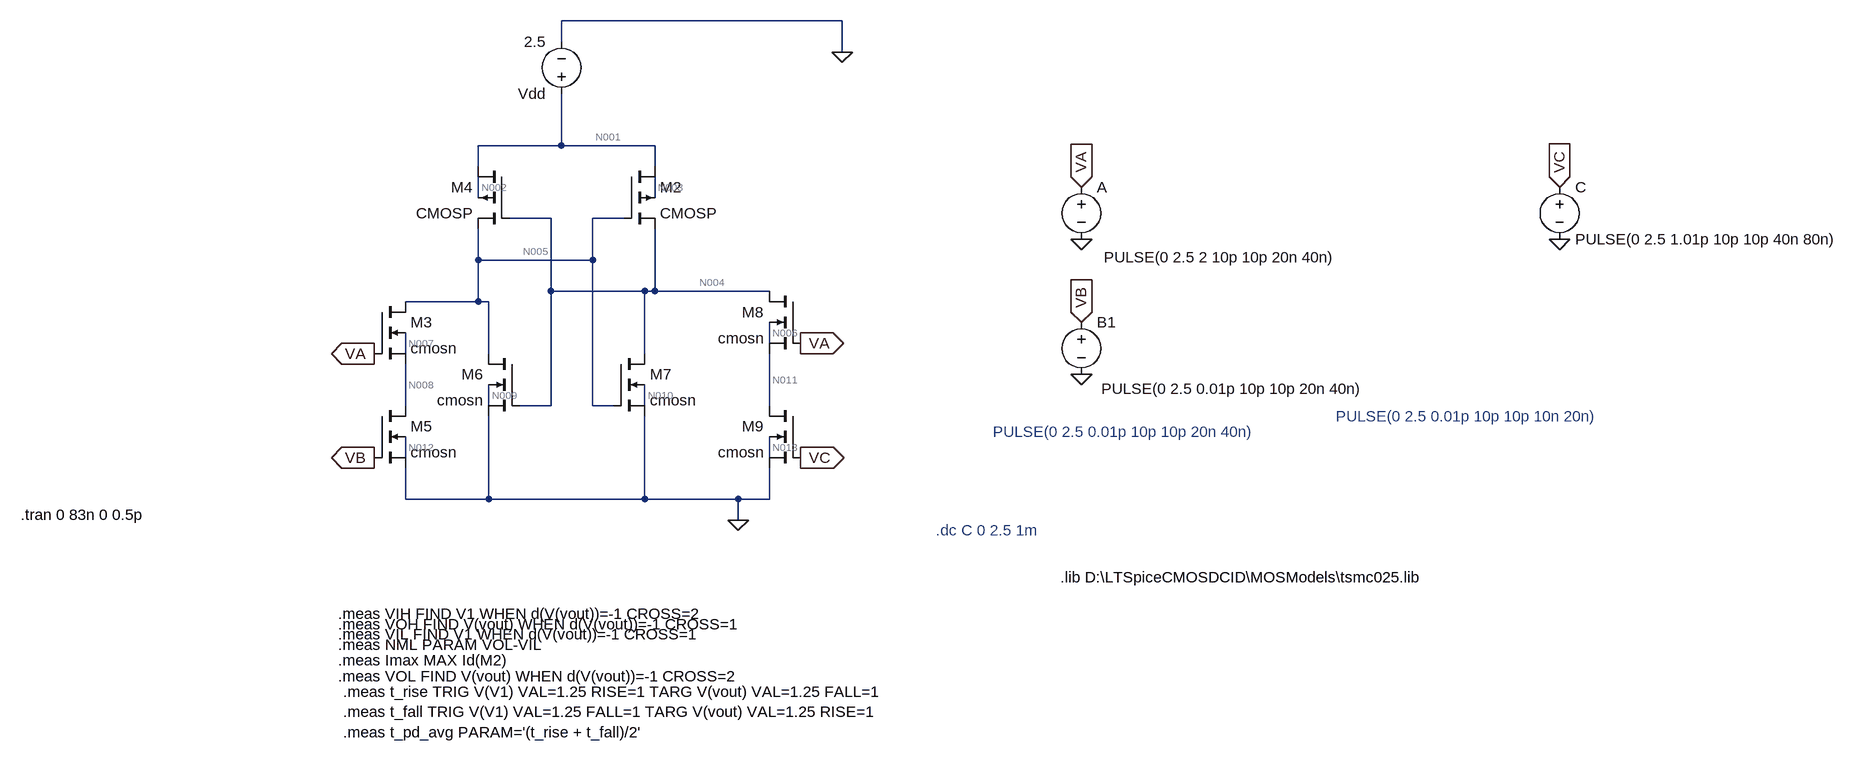
[diagram p0: schematic NOR Latch.asc]
NOR Latch.asc, the LTspice schematic file:
Version 4
SHEET 1 2744 680
WIRE 1184 -512 752 -512
WIRE 752 -480 752 -512
WIRE 1184 -464 1184 -512
WIRE 752 -320 752 -400
WIRE 752 -320 624 -320
WIRE 896 -320 752 -320
WIRE 624 -288 624 -320
WIRE 896 -288 896 -320
WIRE 624 -240 624 -272
WIRE 896 -240 896 -272
WIRE 736 -208 672 -208
WIRE 848 -208 800 -208
WIRE 624 -144 624 -192
WIRE 800 -144 800 -208
WIRE 800 -144 624 -144
WIRE 736 -96 736 -208
WIRE 880 -96 736 -96
WIRE 896 -96 896 -192
WIRE 896 -96 880 -96
WIRE 1072 -96 896 -96
WIRE 624 -80 624 -144
WIRE 624 -80 512 -80
WIRE 640 -80 624 -80
WIRE 1072 -16 1072 -48
WIRE 512 0 512 -32
WIRE 640 0 640 -80
WIRE 880 0 880 -96
WIRE 512 80 512 16
WIRE 640 80 640 48
WIRE 736 80 736 -96
WIRE 736 80 688 80
WIRE 800 80 800 -144
WIRE 832 80 800 80
WIRE 880 80 880 48
WIRE 1072 80 1072 0
WIRE 512 160 512 128
WIRE 1072 160 1072 128
WIRE 512 224 512 176
WIRE 640 224 640 96
WIRE 640 224 512 224
WIRE 880 224 880 96
WIRE 880 224 640 224
WIRE 1024 224 880 224
WIRE 1072 224 1072 176
WIRE 1072 224 1024 224
WIRE 1024 256 1024 224
FLAG 1024 256 0
FLAG 1184 -464 0
FLAG 1552 -256 VA
IOPIN 1552 -256 In
FLAG 2288 -256 VC
IOPIN 2288 -256 In
FLAG 1552 -176 0
FLAG 2288 -176 0
FLAG 1552 -48 VB
IOPIN 1552 -48 In
FLAG 1552 32 0
FLAG 464 0 VA
IOPIN 464 0 Out
FLAG 1120 -16 VA
IOPIN 1120 -16 Out
FLAG 464 160 VB
IOPIN 464 160 Out
FLAG 1120 160 VC
IOPIN 1120 160 Out
SYMBOL voltage 752 -384 R180
WINDOW 123 0 0 Left 0
WINDOW 39 0 0 Left 0
SYMATTR InstName Vdd
SYMATTR Value 2.5
SYMBOL cmosp 672 -288 M0
SYMATTR InstName M4
SYMATTR Value2 l=250n w=360n ad=0.1728p as=0.1728p pd=1680n ps=1680n
SYMBOL voltage 1552 -272 R0
WINDOW 3 35 124 Left 2
WINDOW 123 0 0 Left 0
WINDOW 39 0 0 Left 0
SYMATTR Value PULSE(0 2.5 2 10p 10p 20n 40n)
SYMATTR InstName A
SYMBOL voltage 2288 -272 R0
WINDOW 123 0 0 Left 0
WINDOW 39 0 0 Left 0
SYMATTR InstName C
SYMATTR Value PULSE(0 2.5 1.01p 10p 10p 40n 80n)
SYMBOL voltage 1552 -64 R0
WINDOW 3 31 118 Left 2
WINDOW 123 0 0 Left 0
WINDOW 39 0 0 Left 0
SYMATTR Value PULSE(0 2.5 0.01p 10p 10p 20n 40n)
SYMATTR InstName B1
SYMBOL cmosp 848 -288 R0
SYMATTR InstName M2
SYMATTR Value2 l=250n w=360n ad=0.1728p as=0.1728p pd=1680n ps=1680n
SYMBOL nmos4 464 -80 R0
SYMATTR InstName M3
SYMATTR Value cmosn
SYMATTR Value2 l=250n w=360n ad=0.1728p as=0.1728p pd=1680n ps=1680n
SYMBOL nmos4 464 80 R0
SYMATTR InstName M5
SYMATTR Value cmosn
SYMATTR Value2 l=250n w=360n ad=0.1728p as=0.1728p pd=1680n ps=1680n
SYMBOL nmos4 688 0 M0
SYMATTR InstName M6
SYMATTR Value cmosn
SYMATTR Value2 l=250n w=360n ad=0.1728p as=0.1728p pd=1680n ps=1680n
SYMBOL nmos4 832 0 R0
SYMATTR InstName M7
SYMATTR Value cmosn
SYMATTR Value2 l=250n w=360n ad=0.1728p as=0.1728p pd=1680n ps=1680n
SYMBOL nmos4 1120 -96 M0
SYMATTR InstName M8
SYMATTR Value cmosn
SYMATTR Value2 l=250n w=360n ad=0.1728p as=0.1728p pd=1680n ps=1680n
SYMBOL nmos4 1120 80 M0
SYMATTR InstName M9
SYMATTR Value cmosn
SYMATTR Value2 l=250n w=360n ad=0.1728p as=0.1728p pd=1680n ps=1680n
TEXT 1520 344 Left 2 !.lib D:\\LTSpiceCMOSDCID\\MOSModels\\tsmc025.lib
TEXT 408 496 Left 2 !.meas VOL FIND V(vout) WHEN d(V(vout))=-1 CROSS=2
TEXT 408 400 Left 2 !.meas VIH FIND V1 WHEN d(V(vout))=-1 CROSS=2
TEXT 408 416 Left 2 !.meas VOH FIND V(vout) WHEN d(V(vout))=-1 CROSS=1
TEXT 408 432 Left 2 !.meas VIL FIND V1 WHEN d(V(vout))=-1 CROSS=1
TEXT 408 448 Left 2 !.meas NML PARAM VOL-VIL
TEXT 408 472 Left 2 !.meas Imax MAX Id(M2)
TEXT 416 520 Left 2 !.meas t_rise TRIG V(V1) VAL=1.25 RISE=1 TARG V(vout) VAL=1.25 FALL=1\n.meas t_fall TRIG V(V1) VAL=1.25 FALL=1 TARG V(vout) VAL=1.25 RISE=1\n.meas t_pd_avg PARAM='(t_rise + t_fall)/2'
TEXT -80 248 Left 2 !.tran 0 83n 0 0.5p
TEXT 1328 272 Left 2 ;.dc C 0 2.5 1m
TEXT 1416 120 Left 2 ;PULSE(0 2.5 0.01p 10p 10p 20n 40n)
TEXT 1944 96 Left 2 ;PULSE(0 2.5 0.01p 10p 10p 10n 20n)

The netlist it stands for:
* NOR Latch.asc
Vdd N001 0 2.5
M4 N001 N004 N005 N002 CMOSP l=250n w=360n ad=0.1728p as=0.1728p pd=1680n ps=1680n
V§A VA 0 PULSE(0 2.5 2 10p 10p 20n 40n)
V§C VC 0 PULSE(0 2.5 1.01p 10p 10p 40n 80n)
V§B1 VB 0 PULSE(0 2.5 0.01p 10p 10p 20n 40n)
M2 N001 N005 N004 N003 CMOSP l=250n w=360n ad=0.1728p as=0.1728p pd=1680n ps=1680n
M3 N005 VA N008 N007 cmosn l=250n w=360n ad=0.1728p as=0.1728p pd=1680n ps=1680n
M5 N008 VB 0 N012 cmosn l=250n w=360n ad=0.1728p as=0.1728p pd=1680n ps=1680n
M6 N005 N004 0 N009 cmosn l=250n w=360n ad=0.1728p as=0.1728p pd=1680n ps=1680n
M7 N004 N005 0 N010 cmosn l=250n w=360n ad=0.1728p as=0.1728p pd=1680n ps=1680n
M8 N004 VA N011 N006 cmosn l=250n w=360n ad=0.1728p as=0.1728p pd=1680n ps=1680n
M9 N011 VC 0 N013 cmosn l=250n w=360n ad=0.1728p as=0.1728p pd=1680n ps=1680n
.model NMOS NMOS
.model PMOS PMOS
.lib standard.mos
.lib D:\LTSpiceCMOSDCID\MOSModels\tsmc025.lib
.meas VOL FIND V(vout) WHEN d(V(vout))=-1 CROSS=2
.meas VIH FIND V1 WHEN d(V(vout))=-1 CROSS=2
.meas VOH FIND V(vout) WHEN d(V(vout))=-1 CROSS=1
.meas VIL FIND V1 WHEN d(V(vout))=-1 CROSS=1
.meas NML PARAM VOL-VIL
.meas Imax MAX Id(M2)
.meas t_rise TRIG V(V1) VAL=1.25 RISE=1 TARG V(vout) VAL=1.25 FALL=1
.meas t_fall TRIG V(V1) VAL=1.25 FALL=1 TARG V(vout) VAL=1.25 RISE=1
.meas t_pd_avg PARAM='(t_rise + t_fall)/2'
.tran 0 83n 0 0.5p
* .dc C 0 2.5 1m
* PULSE(0 2.5 0.01p 10p 10p 20n 40n)
* PULSE(0 2.5 0.01p 10p 10p 10n 20n)
.backanno
.end

* Results of the author's LTspice run, read from the files saved beside the schematic
* Operating Point, zero values left out:
*   V(n001) = 2.5 V
*   V(n004) = 931 mV
*   V(n005) = 931 mV
*   V(n002) = 2.222 V
*   V(n003) = 2.222 V
*   V(n008) = 227.8 mV
*   V(n007) = 374.8 mV
*   V(n012) = 75.28 mV
*   V(n009) = 204.4 mV
*   V(n010) = 204.4 mV
*   V(n011) = 227.8 mV
*   V(n006) = 374.8 mV
*   V(n013) = 75.28 mV
*   Id(M4) = 21.59 µA
*   Ib(M4) = -2.222 pA
*   Is(M4) = -21.59 µA
*   Id(M2) = 21.59 µA
*   Ib(M2) = -2.222 pA
*   Is(M2) = -21.59 µA
*   Id(M6) = 21.59 µA
*   Is(M6) = -21.59 µA
*   Id(M7) = 21.59 µA
*   Is(M7) = -21.59 µA
*   I(Vdd) = -43.18 µA
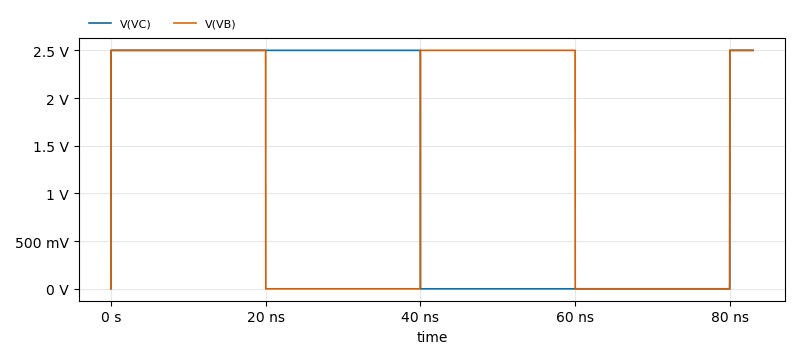
[diagram p1: Transient Analysis of NOR Latch.asc, plotted from the saved traces]
* Transient Analysis, 1 run:
*   V(VC): min 0 V, max 2.5 V, average 1.295 V, rms 1.799 V, last 2.5 V
*   V(VB): min 0 V, max 2.5 V, average 1.296 V, rms 1.8 V, last 2.5 V
* From the log:
*   Measurement "vol" FAIL'ed
*   Measurement "vih" FAIL'ed
*   Measurement "voh" FAIL'ed
*   Measurement "vil" FAIL'ed
*   Measurement "nml" FAIL'ed
*   imax: MAX(id(m2))=3.31802e-05 FROM 0 TO 8.3e-08
*   Measurement "t_rise" FAIL'ed
*   Measurement "t_fall" FAIL'ed
*   Measurement "t_pd_avg" FAIL'ed